# Altium schematic sheet 08_Target_Bd_Connector.SchDoc
size A4; SheetNumber: 8; SheetTotal: 8
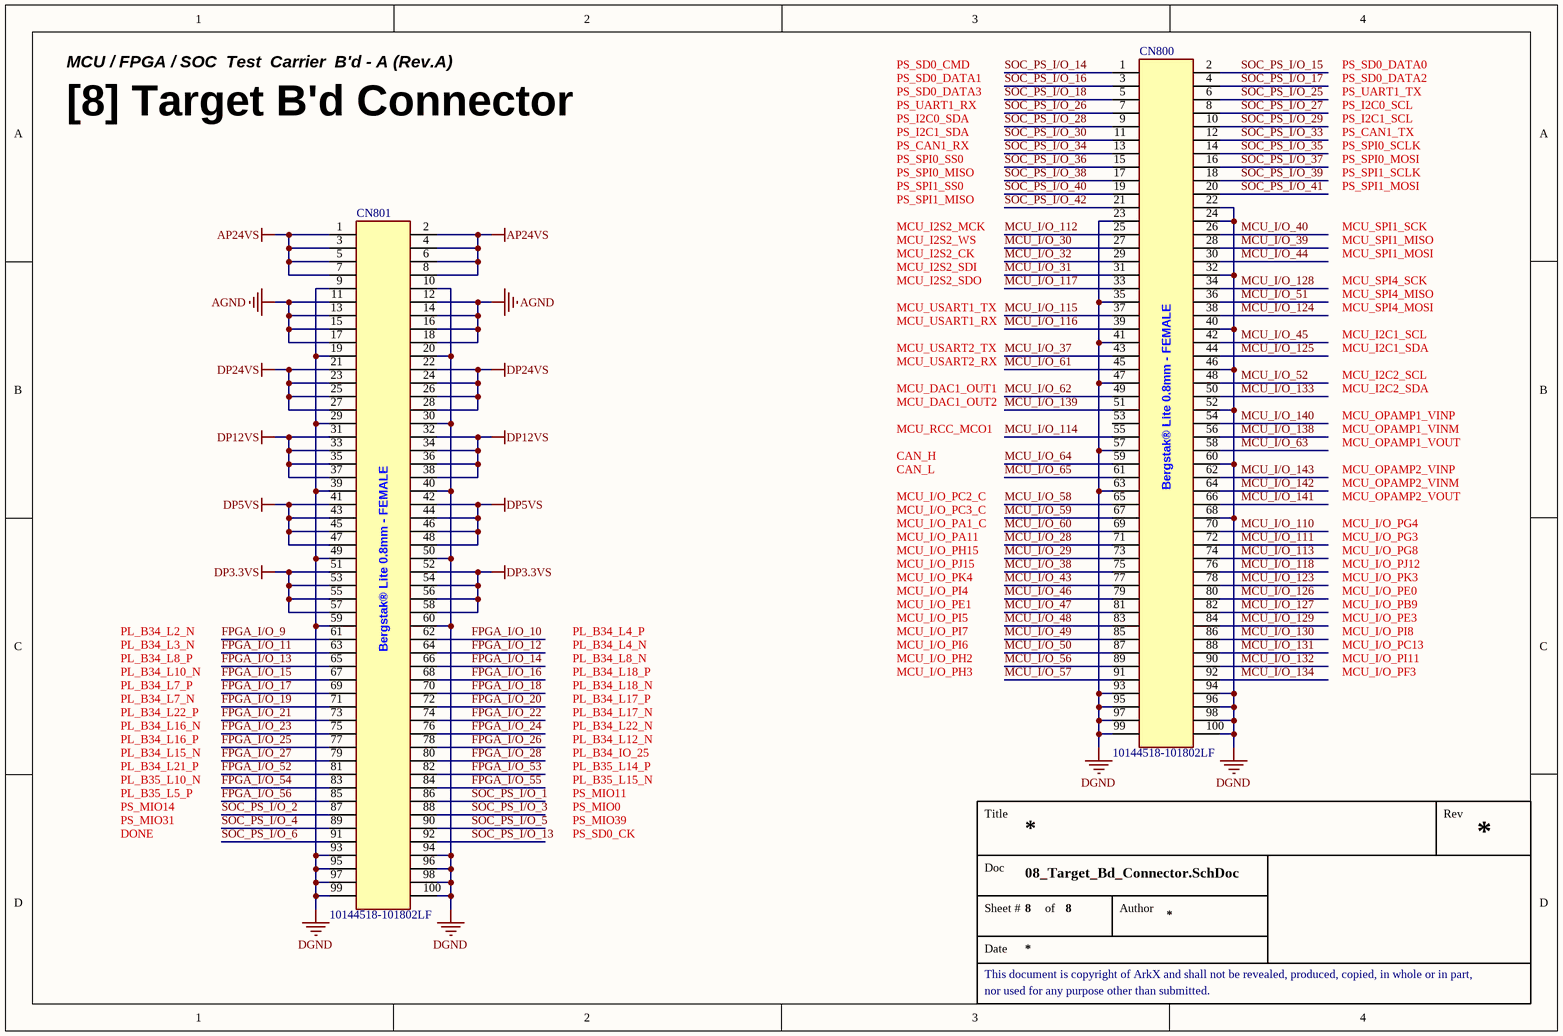
[diagram p0: 08_Target_Bd_Connector.SchDoc]

## Parts
CN800  10144518-101802LF  [CON_BergStak-Lite(0.8mm)_FEMALE-100P(10144518-101802LF)_HandSolder]
CN801  10144518-101802LF  [CON_BergStak-Lite(0.8mm)_FEMALE-100P(10144518-101802LF)_HandSolder]

## Nets
AGND: CN801.11 CN801.12 CN801.13 CN801.14 CN801.15 CN801.16 CN801.17 CN801.18
AP24VS: CN801.1 CN801.2 CN801.3 CN801.4 CN801.5 CN801.6 CN801.7 CN801.8
DGND: CN800.22 CN800.23 CN800.24 CN800.32 CN800.35 CN800.40 CN800.41 CN800.46 CN800.47 CN800.52 CN800.57 CN800.60 CN800.63 CN800.68 CN800.93 CN800.94 CN800.95 CN800.96 CN800.97 CN800.98 CN800.99 CN800.100 CN801.9 CN801.10 CN801.19 CN801.20 CN801.29 CN801.30 CN801.39 CN801.40 CN801.49 CN801.50 CN801.59 CN801.60 CN801.93 CN801.94 CN801.95 CN801.96 CN801.97 CN801.98 CN801.99 CN801.100
DP3.3VS: CN801.51 CN801.52 CN801.53 CN801.54 CN801.55 CN801.56 CN801.57 CN801.58
DP5VS: CN801.41 CN801.42 CN801.43 CN801.44 CN801.45 CN801.46 CN801.47 CN801.48
DP12VS: CN801.31 CN801.32 CN801.33 CN801.34 CN801.35 CN801.36 CN801.37 CN801.38
DP24VS: CN801.21 CN801.22 CN801.23 CN801.24 CN801.25 CN801.26 CN801.27 CN801.28
FPGA_I/O_9: CN801.61
FPGA_I/O_10: CN801.62
FPGA_I/O_11: CN801.63
FPGA_I/O_12: CN801.64
FPGA_I/O_13: CN801.65
FPGA_I/O_14: CN801.66
FPGA_I/O_15: CN801.67
FPGA_I/O_16: CN801.68
FPGA_I/O_17: CN801.69
FPGA_I/O_18: CN801.70
FPGA_I/O_19: CN801.71
FPGA_I/O_20: CN801.72
FPGA_I/O_21: CN801.73
FPGA_I/O_22: CN801.74
FPGA_I/O_23: CN801.75
FPGA_I/O_24: CN801.76
FPGA_I/O_25: CN801.77
FPGA_I/O_26: CN801.78
FPGA_I/O_27: CN801.79
FPGA_I/O_28: CN801.80
FPGA_I/O_52: CN801.81
FPGA_I/O_53: CN801.82
FPGA_I/O_54: CN801.83
FPGA_I/O_55: CN801.84
FPGA_I/O_56: CN801.85
MCU_I/O_28: CN800.71
MCU_I/O_29: CN800.73
MCU_I/O_30: CN800.27
MCU_I/O_31: CN800.31
MCU_I/O_32: CN800.29
MCU_I/O_37: CN800.43
MCU_I/O_38: CN800.75
MCU_I/O_39: CN800.28
MCU_I/O_40: CN800.26
MCU_I/O_43: CN800.77
MCU_I/O_44: CN800.30
MCU_I/O_45: CN800.42
MCU_I/O_46: CN800.79
MCU_I/O_47: CN800.81
MCU_I/O_48: CN800.83
MCU_I/O_49: CN800.85
MCU_I/O_50: CN800.87
MCU_I/O_51: CN800.36
MCU_I/O_52: CN800.48
MCU_I/O_56: CN800.89
MCU_I/O_57: CN800.91
MCU_I/O_58: CN800.65
MCU_I/O_59: CN800.67
MCU_I/O_60: CN800.69
MCU_I/O_61: CN800.45
MCU_I/O_62: CN800.49
MCU_I/O_63: CN800.58
MCU_I/O_64: CN800.59
MCU_I/O_65: CN800.61
MCU_I/O_110: CN800.70
MCU_I/O_111: CN800.72
MCU_I/O_112: CN800.25
MCU_I/O_113: CN800.74
MCU_I/O_114: CN800.55
MCU_I/O_115: CN800.37
MCU_I/O_116: CN800.39
MCU_I/O_117: CN800.33
MCU_I/O_118: CN800.76
MCU_I/O_123: CN800.78
MCU_I/O_124: CN800.38
MCU_I/O_125: CN800.44
MCU_I/O_126: CN800.80
MCU_I/O_127: CN800.82
MCU_I/O_128: CN800.34
MCU_I/O_129: CN800.84
MCU_I/O_130: CN800.86
MCU_I/O_131: CN800.88
MCU_I/O_132: CN800.90
MCU_I/O_133: CN800.50
MCU_I/O_134: CN800.92
MCU_I/O_138: CN800.56
MCU_I/O_139: CN800.51
MCU_I/O_140: CN800.54
MCU_I/O_141: CN800.66
MCU_I/O_142: CN800.64
MCU_I/O_143: CN800.62
SOC_PS_I/O_1: CN801.86
SOC_PS_I/O_2: CN801.87
SOC_PS_I/O_3: CN801.88
SOC_PS_I/O_4: CN801.89
SOC_PS_I/O_5: CN801.90
SOC_PS_I/O_6: CN801.91
SOC_PS_I/O_13: CN801.92
SOC_PS_I/O_14: CN800.1
SOC_PS_I/O_15: CN800.2
SOC_PS_I/O_16: CN800.3
SOC_PS_I/O_17: CN800.4
SOC_PS_I/O_18: CN800.5
SOC_PS_I/O_25: CN800.6
SOC_PS_I/O_26: CN800.7
SOC_PS_I/O_27: CN800.8
SOC_PS_I/O_28: CN800.9
SOC_PS_I/O_29: CN800.10
SOC_PS_I/O_30: CN800.11
SOC_PS_I/O_33: CN800.12
SOC_PS_I/O_34: CN800.13
SOC_PS_I/O_35: CN800.14
SOC_PS_I/O_36: CN800.15
SOC_PS_I/O_37: CN800.16
SOC_PS_I/O_38: CN800.17
SOC_PS_I/O_39: CN800.18
SOC_PS_I/O_40: CN800.19
SOC_PS_I/O_41: CN800.20
SOC_PS_I/O_42: CN800.21

Not connected (* = marked no-connect by the designer): CN800 53

## Notes on the sheet
- MCU / FPGA / SOC  Test  Carrier  B'd - A (Rev.A)
- PS_SD0_CMD
- PS_SD0_DATA1
- PS_SD0_DATA3
- PS_UART1_RX
- PS_SD0_DATA0
- PS_SD0_DATA2
- PS_UART1_TX
- PS_I2C0_SCL
- [8] Target B'd Connector
- PS_I2C0_SDA
- PS_I2C1_SDA
- PS_CAN1_RX
- PS_SPI0_SS0
- PS_SPI0_MISO
- PS_I2C1_SCL
- PS_CAN1_TX
- PS_SPI0_SCLK
- PS_SPI0_MOSI
- PS_SPI1_SCLK
- MCU_I2S2_WS
- MCU_I2S2_MCK
- PS_SPI1_SS0
- PS_SPI1_MISO
- MCU_SPI1_SCK
- MCU_SPI1_MISO
- PS_SPI1_MOSI
- MCU_I2S2_CK
- MCU_I2S2_SDI
- MCU_I2S2_SDO
- MCU_USART1_TX
- MCU_SPI1_MOSI
- MCU_SPI4_SCK
- MCU_SPI4_MISO
- MCU_SPI4_MOSI
- MCU_USART1_RX
- MCU_USART2_TX
- MCU_USART2_RX
- MCU_I2C1_SCL
- MCU_I2C1_SDA
- MCU_I2C2_SCL
- MCU_DAC1_OUT1
- MCU_DAC1_OUT2
- MCU_RCC_MCO1
- MCU_I2C2_SDA
- MCU_OPAMP1_VOUT
- MCU_OPAMP1_VINM
- MCU_OPAMP1_VINP
- CAN_H
- CAN_L
- MCU_I/O_PC2_C
- MCU_I/O_PC3_C
- MCU_OPAMP2_VOUT
- MCU_OPAMP2_VINM
- MCU_OPAMP2_VINP
- MCU_I/O_PA1_C
- MCU_I/O_PA11
- MCU_I/O_PH15
- MCU_I/O_PJ15
- MCU_I/O_PK4
- MCU_I/O_PG4
- MCU_I/O_PG3
- MCU_I/O_PG8
- MCU_I/O_PJ12
- MCU_I/O_PK3
- PL_B34_L2_N
- PL_B34_L3_N
- PL_B34_L4_P
- PL_B34_L4_N
- MCU_I/O_PI4
- MCU_I/O_PE1
- MCU_I/O_PI5
- MCU_I/O_PI7
- MCU_I/O_PI6
- MCU_I/O_PE0
- MCU_I/O_PB9
- MCU_I/O_PE3
- MCU_I/O_PI8
- MCU_I/O_PC13
- PL_B34_L8_P
- PL_B34_L10_N
- PL_B34_L7_P
- PL_B34_L7_N
- PL_B34_L22_P
- PL_B34_L8_N
- PL_B34_L18_P
- PL_B34_L18_N
- PL_B34_L17_P
- PL_B34_L17_N
- MCU_I/O_PH2
- MCU_I/O_PH3
- MCU_I/O_PI11
- MCU_I/O_PF3
- PL_B34_L16_N
- PL_B34_L16_P
- PL_B34_L15_N
- PL_B34_L21_P
- PL_B35_L10_N
- PL_B34_L22_N
- PL_B34_L12_N
- PL_B34_IO_25
- PL_B35_L14_P
- PL_B35_L15_N
- PL_B35_L5_P
- PS_MIO14
- PS_MIO31
- DONE
- PS_MIO11
- PS_MIO0
- PS_MIO39
- PS_SD0_CK
- Title
- Rev
- Doc
- Sheet #
- of
- Author
- This document is copyright of ArkX and shall not be revealed, produced, copied, in whole or in part,
- Date
- nor used for any purpose other than submitted.
- (in symbol CON_BergStak-Lite(0.8mm)_FEMALE-100P(10144518-101802LF)) Bergstak® Lite 0.8mm - FEMALE

## Library data of the parts
CN800 CN801 = CON_BergStak-Lite(0.8mm)_FEMALE-100P(10144518-101802LF): JLCPCB Part Type: Extended Part